# Altium schematic sheet programmer_charter.SchDoc
size A
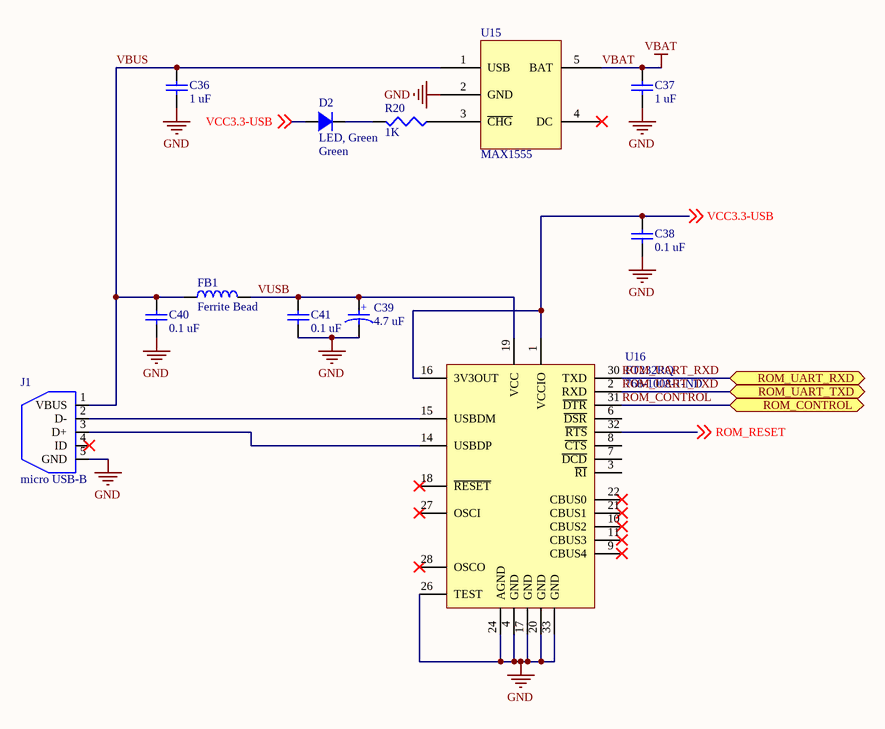
[diagram p0: programmer_charter.SchDoc]

## Parts
C36  value 1 uF  [0402]  (hidden comment: Ceramic capacitor)
C37  value 1 uF  [0402]  (hidden comment: Ceramic capacitor)
C38  value 0.1 uF  [0402]  (hidden comment: Ceramic capacitor)
C39  value 4.7 uF  [0603 - Polar Marking]  (hidden comment: Tantalum capacitor)
C40  value 0.1 uF  [0402]  (hidden comment: Ceramic capacitor)
C41  value 0.1 uF  [0402]  (hidden comment: Ceramic capacitor)
D2  LED, Green  Color: Green  [0402 - DIODE]
FB1  Ferrite Bead  [0402]
J1  micro USB-B  [Micro USB-B]
R20  value 1K  [0402]  (hidden comment: Chip resistor)
U15  MAX1555  [SOT23-5]
U16  FT232RQ  Supplier Part Number 1: 768-1008-1-ND  [QFN-32]

## Ports
ROM_CONTROL, ROM_UART_RXD, ROM_UART_TXD

## Nets
GND: C36.2 C37.2 C38.2 C39.2 C40.2 C41.2 J1.5(GND) U15.2(GND) U16.4(GND) U16.17(GND) U16.20(GND) U16.24(AGND) U16.26(TEST) U16.33(GND)
VBAT: C37.1 U15.5(BAT)
ROM_CONTROL: U16.31(~{DTR}) ; port ROM_CONTROL
ROM_RESET: U16.32(~{RTS}) ; off-sheet ROM_RESET
ROM_UART_RXD: U16.30(TXD) ; port ROM_UART_RXD
ROM_UART_TXD: U16.2(RXD) ; port ROM_UART_TXD
VBUS: C36.1 C40.1 FB1.2 J1.1(VBUS) U15.1(USB)
VCC3.3-USB: C38.1 D2.1 U16.1(VCCIO) U16.16(3V3OUT) ; off-sheet VCC3.3-USB
VUSB: C39.1 C41.1 FB1.1 U16.19(VCC)
NetD2_2: D2.2 R20.1
NetJ1_2: J1.2(D-) U16.15(USBDM)
NetJ1_3: J1.3(D+) U16.14(USBDP)
NetR20_2: R20.2 U15.3(~{CHG})

Not connected (* = marked no-connect by the designer): J1 4(ID)*; U15 4(DC)*; U16 3(~{RI}) 6(~{DSR}) 7(~{DCD}) 8(~{CTS}) 9(CBUS4)* 10(CBUS2)* 11(CBUS3)* 18(~{RESET})* 21(CBUS1)* 22(CBUS0)* 27(OSCI)* 28(OSCO)*

## Notes on the sheet
- (in symbol C_4.7u_0603_tantalum) +

## Library data of the parts
C36 C37 = C_1u_0402_ceramic: Ceramic capacitor, 1 uF, 0402 package; Manufacture: TDK; voltage rated: 6.3 V; tolerance: 10%; package: 0402; Supplier 1: Digi-Key; Supplier Part Number 1: 445-5000-1-ND
C38 C40 C41 = C_0.1u_0402_ceramic: Ceramic capacitor, 0.1u, 0402 package; Manufacture: TDK; voltage rated: 10 V; tolerance: 10%; Supplier 1: Digi-Key; Supplier Part Number 1: 445-1265-1-ND; package: 0402
C39 = C_4.7u_0603_tantalum: Tantalum capacitor, 4.7 uF, 0603 package; Manufacture: Rohm; voltage rated: 10 V; tolerance: 20%; package: 0603; Supplier 1: Digi-Key; Supplier Part Number 1: 511-1496-1-ND
D2 = D_LED_GREEN_0402: LED, Green,  0402; package: 0402; Supplier 1: Digi-Key; Supplier Part Number 1: 511-1592-1-ND
FB1 = FB_150mA_0402: Ferrite Bead, 150 mA, 0402 package; impedance@Freq: 1K@100 MHz; current rating: 150 mA; Supplier 1: Digi-Key; Supplier Part Number 1: 587-1835-1-ND; package: 0402
J1 = Micro USB: CONN USB MICRO B RECPT SMT R/A; Supplier 1: Digi-Key; Supplier Part Number 1: 609-4616-6-ND
R20 = R_1K_0402: Chip resistor, 1K, 0402 package; tolerance: 1%; power: 1/16 W; Supplier 1: Digi-Key; Supplier Part Number 1: 541-1.00KLCT-ND; package: 0402
U15 = MAX1555: 3 Dual-Input USB/AC Adapter 1-Cell Li+  Battery Chargers; Supplier 1: Digi-Key; Supplier Part Number 1: MAX1555EZK+TTR-ND
U16 = IC_FT232RQ: FT232R USB UART; Manufacturer: *; Note: *; ManufacturerPartNo: *; Supplier 1: Digi-Key